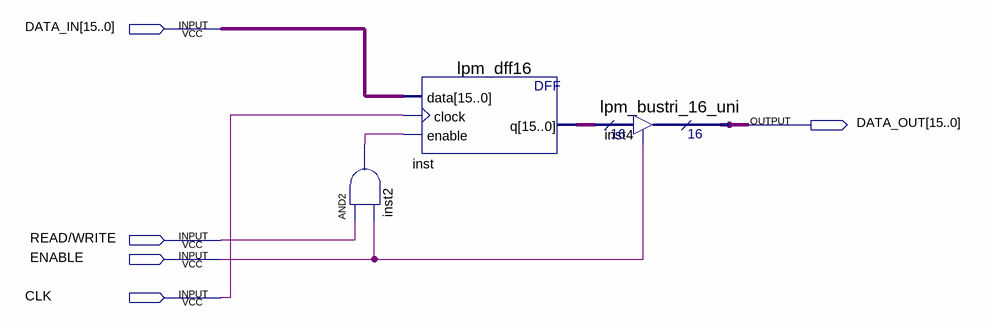
[diagram p0: schematic sheet]
// Quartus schematic register16.bdf as structural Verilog: 3 symbols, 5 pins
module register16 (
  input  [15:0] DATA_IN,
  input  \READ/WRITE ,
  input  ENABLE,
  input  CLK,
  output [15:0] DATA_OUT
);

  wire inst2_out;
  wire [15:0] inst_q;

  and inst2 (inst2_out, \READ/WRITE , ENABLE);
  lpm_dff16 inst (.data(DATA_IN), .clock(CLK), .enable(inst2_out), .q(inst_q));
  lpm_bustri_16_uni inst4 (.enabledt(ENABLE), .data(inst_q), .tridata(DATA_OUT));
endmodule
